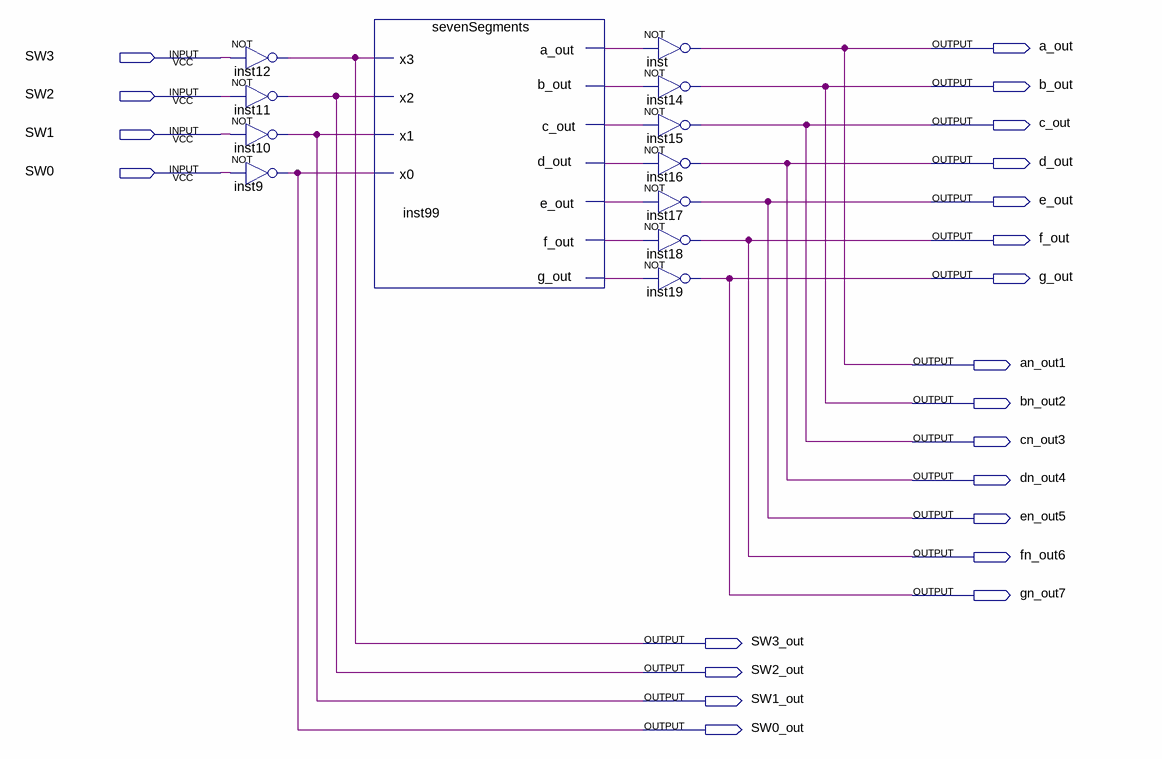
[diagram p0: schematic sheet]
// Quartus schematic interface_sevSeg.bdf as structural Verilog: 12 symbols, 22 pins
module interface_sevSeg (
  input  SW3,
  input  SW2,
  input  SW1,
  input  SW0,
  output a_out,
  output b_out,
  output c_out,
  output d_out,
  output e_out,
  output f_out,
  output g_out,
  output an_out1,
  output bn_out2,
  output cn_out3,
  output dn_out4,
  output en_out5,
  output fn_out6,
  output gn_out7,
  output SW3_out,
  output SW2_out,
  output SW1_out,
  output SW0_out
);

  wire inst99_a_out, inst99_b_out, inst99_c_out, inst99_d_out, inst99_e_out, inst99_f_out, inst99_g_out;

  not inst12 (SW3_out, SW3);
  not inst11 (SW2_out, SW2);
  not inst10 (SW1_out, SW1);
  not inst9 (SW0_out, SW0);
  sevenSegments inst99 (
    .x3(SW3_out), .x2(SW2_out), .x1(SW1_out), .x0(SW0_out), .a_out(inst99_a_out), .b_out(inst99_b_out),
    .c_out(inst99_c_out), .d_out(inst99_d_out), .e_out(inst99_e_out), .f_out(inst99_f_out),
    .g_out(inst99_g_out));
  not inst (a_out, inst99_a_out);
  not inst14 (b_out, inst99_b_out);
  not inst15 (c_out, inst99_c_out);
  not inst16 (d_out, inst99_d_out);
  not inst17 (e_out, inst99_e_out);
  not inst18 (f_out, inst99_f_out);
  not inst19 (g_out, inst99_g_out);

  assign an_out1 = a_out;
  assign bn_out2 = b_out;
  assign cn_out3 = c_out;
  assign dn_out4 = d_out;
  assign en_out5 = e_out;
  assign fn_out6 = f_out;
  assign gn_out7 = g_out;
endmodule
